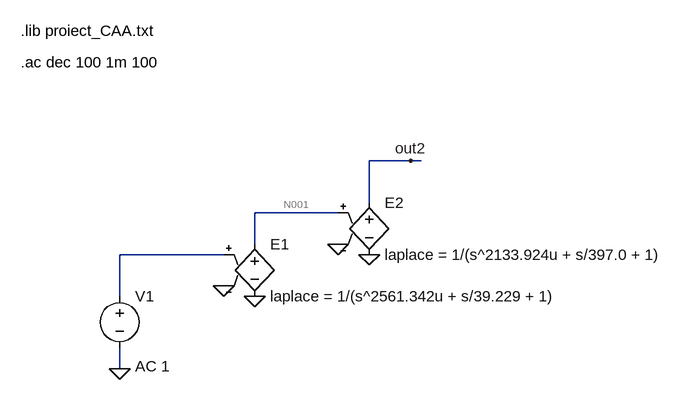
[diagram p0: schematic Draft1.asc]
Draft1.asc, the LTspice schematic file:
Version 4
SHEET 1 2312 680
WIRE 528 256 464 256
WIRE 544 256 528 256
WIRE 464 320 464 256
WIRE 416 336 288 336
WIRE 288 384 288 336
WIRE 240 400 80 400
WIRE 80 464 80 400
WIRE 80 576 80 544
FLAG 240 448 0
FLAG 288 464 0
FLAG 416 384 0
FLAG 464 400 0
FLAG 80 576 0
FLAG 528 256 out2
SYMBOL e 288 368 R0
SYMATTR InstName E1
SYMATTR Value laplace = 1/(s^2561.342u + s/39.229 + 1)
SYMBOL e 464 304 R0
SYMATTR InstName E2
SYMATTR Value laplace = 1/(s^2133.924u + s/397.0 + 1)
SYMBOL voltage 80 448 R0
WINDOW 123 24 124 Left 2
WINDOW 39 0 0 Left 0
WINDOW 3 24 44 Left 2
SYMATTR Value2 AC 1
SYMATTR Value ""
SYMATTR InstName V1
TEXT -72 56 Left 2 !.lib proiect_CAA.txt
TEXT -72 104 Left 2 !.ac dec 100 1m 100

The netlist it stands for:
* Draft1.asc
E1 N001 0 N002 0 laplace = 1/(s^2561.342u + s/39.229 + 1)
E2 out2 0 N001 0 laplace = 1/(s^2133.924u + s/397.0 + 1)
V1 N002 0 AC 1
.lib proiect_CAA.txt
.ac dec 100 1m 100
.backanno
.end

* Results of the author's LTspice run, read from the files saved beside the schematic
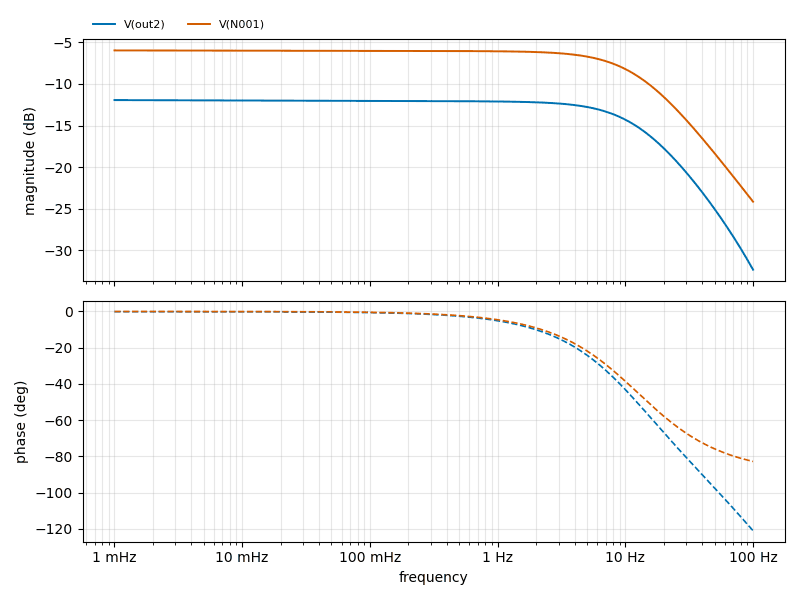
[diagram p1: AC Analysis of Draft1.asc, plotted from the saved traces]
* AC Analysis, 1 run:
*   V(out2): -11.94 dB at 1 mHz, -32.34 dB at 100 Hz, peak -11.94 dB at 1 mHz, 3 dB below the peak at 11.86 Hz
*   V(N001): -5.96 dB at 1 mHz, -24.16 dB at 100 Hz, peak -5.96 dB at 1 mHz, 3 dB below the peak at 12.23 Hz